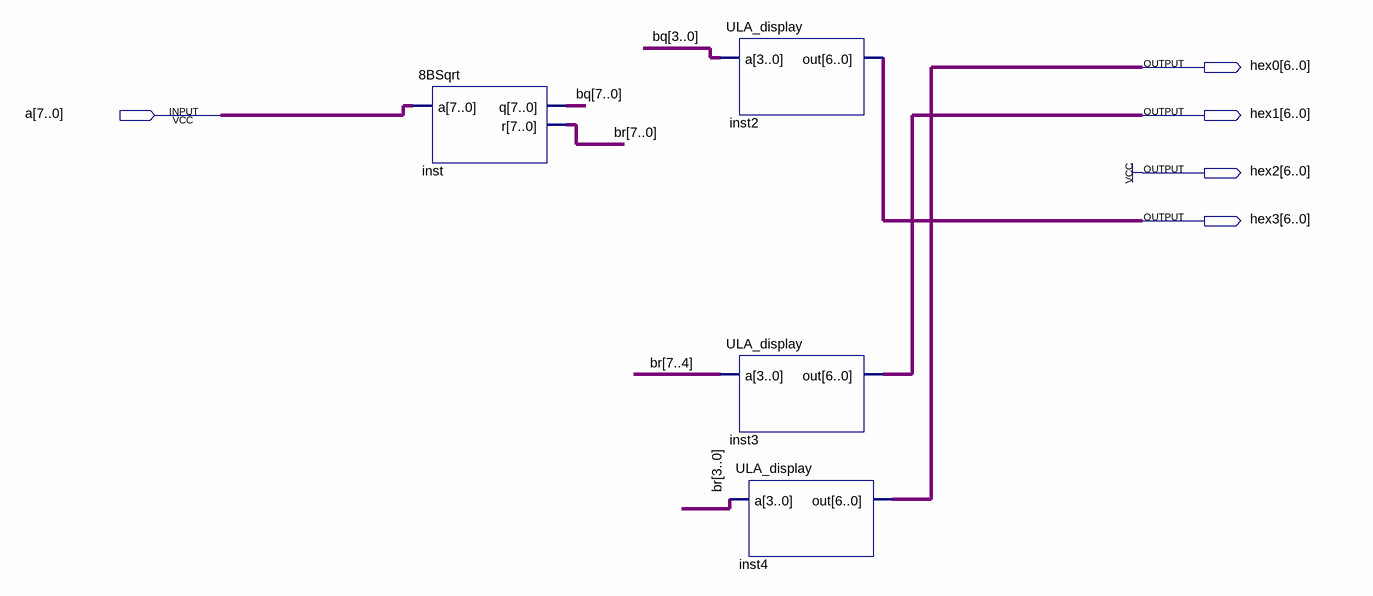
[diagram p0: schematic sheet]
// Quartus schematic ULA_sqrt.bdf as structural Verilog: 4 symbols, 5 pins
module ULA_sqrt (
  input  [7:0] a,
  output [6:0] hex0,
  output [6:0] hex1,
  output [6:0] hex2,
  output [6:0] hex3
);

  wire [7:0] bq, br;

  \8BSqrt  inst (.a(a), .q(bq), .r(br));
  ULA_display inst2 (.a(bq[3:0]), .out(hex3));
  ULA_display inst3 (.a(br[7:4]), .out(hex1));
  ULA_display inst4 (.a(br[3:0]), .out(hex0));

  assign hex2 = {7{1'b1}};
endmodule
